# EAGLE design IOT (EAGLE 9.7.0)
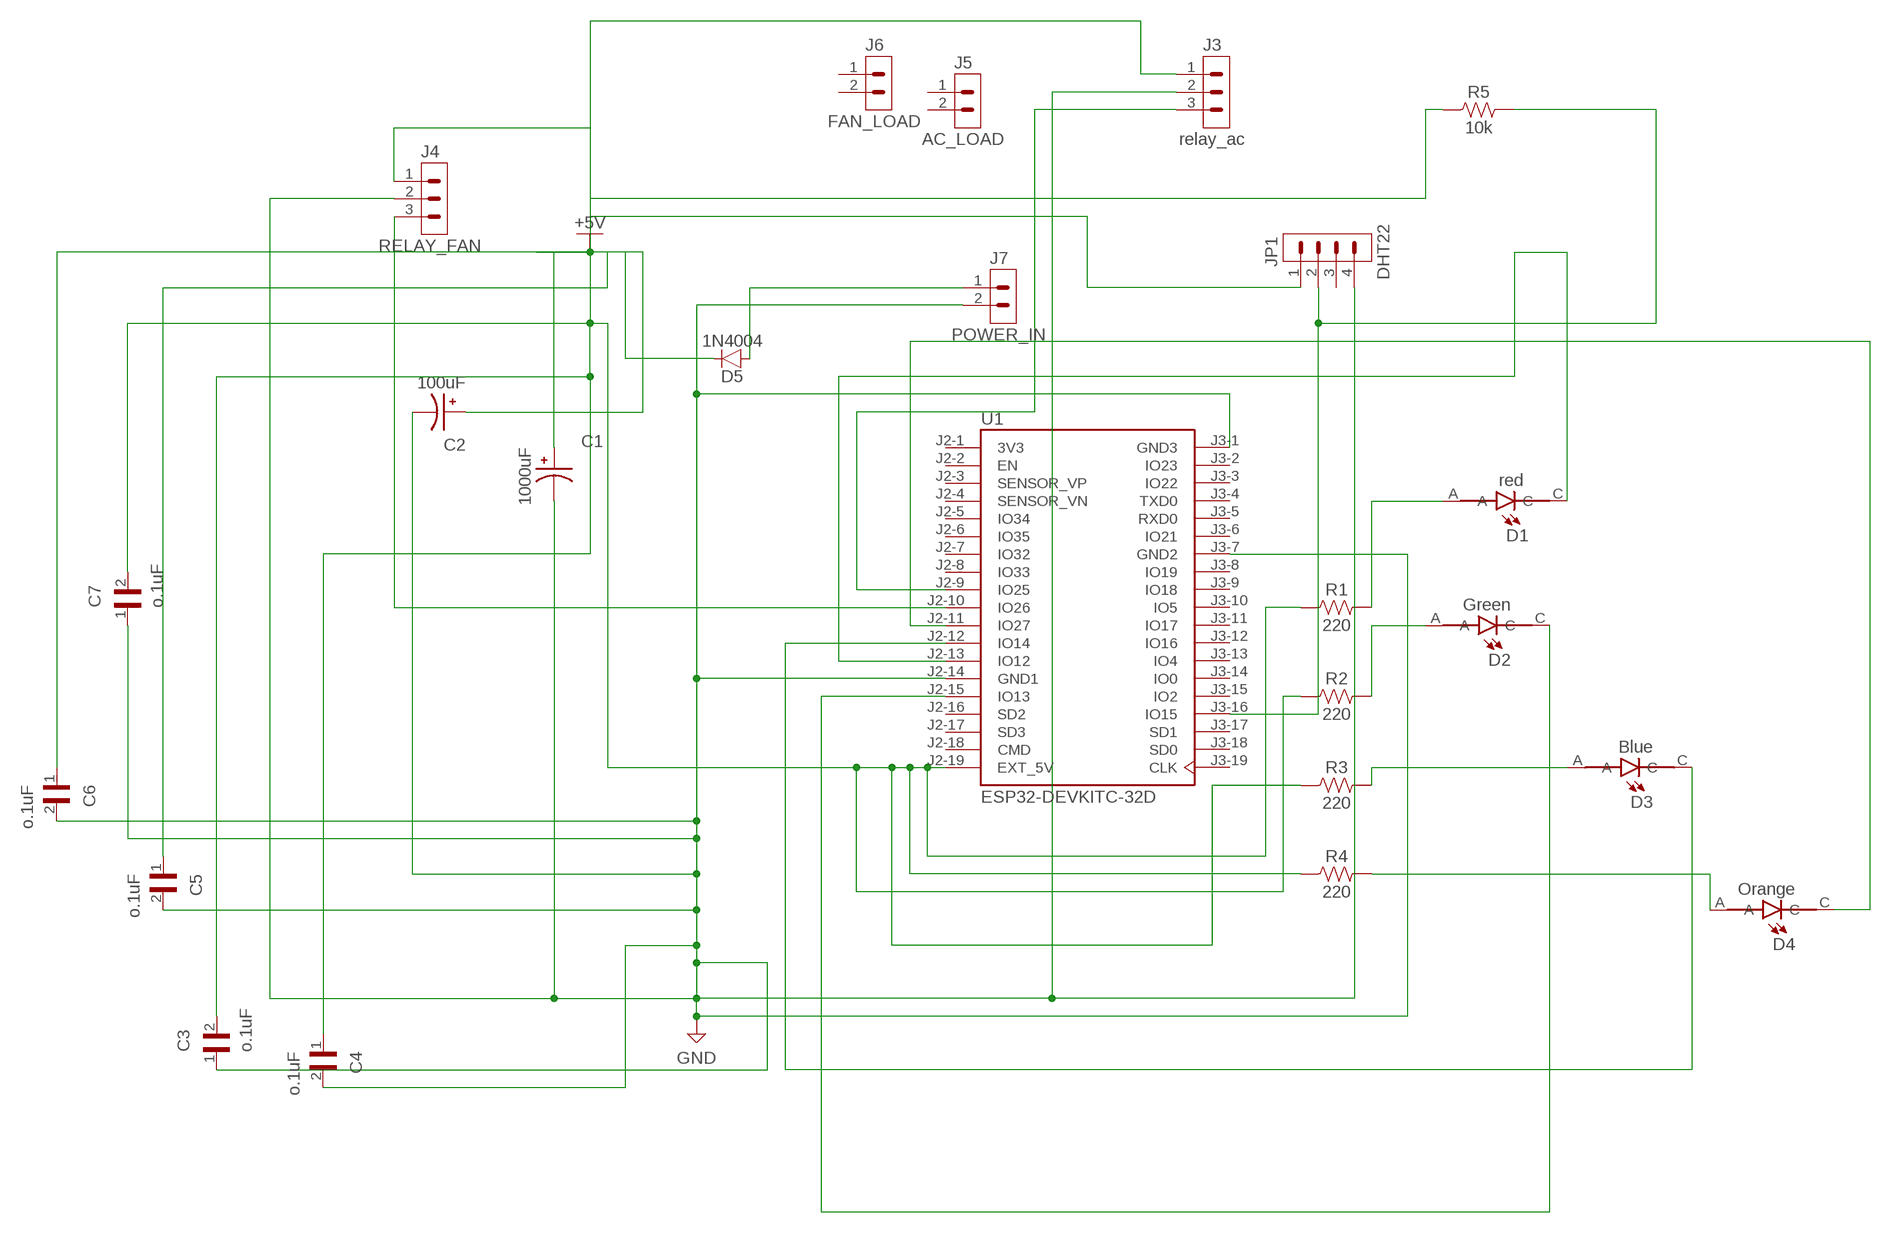
[diagram p0: schematic, sheet 1]

## Parts
C1  1000uF  UPM1K560MPD6  [CAPPRD500W60D1000H1700]
C2  100uF  UPM1K560MPD6  [CAPPRD500W60D1000H1700]
C3  o.1uF  FG26X7R1E106KRT00  [CAPRB500W50L550T350H600]
C4  o.1uF  FG26X7R1E106KRT00  [CAPRB500W50L550T350H600]
C5  o.1uF  FG26X7R1E106KRT00  [CAPRB500W50L550T350H600]
C6  o.1uF  FG26X7R1E106KRT00  [CAPRB500W50L550T350H600]
C7  o.1uF  FG26X7R1E106KRT00  [CAPRB500W50L550T350H600]
D1  red  WP7113ID  [LED_WP7113ID]
D2  Green  WP7113ID  [LED_WP7113ID]
D3  Blue  WP7113ID  [LED_WP7113ID]
D4  Orange  WP7113ID  [LED_WP7113ID]
D5  1N4004  DIODE_1N4004_DO41-10  [DO41-10]
J3  relay_ac  B3P-VH  [B3P-VH_396_3N]
J4  RELAY_FAN  B3P-VH  [B3P-VH_396_3N]
J5  AC_LOAD  B2P-VH  [B2P-VH_396-2N]
J6  FAN_LOAD  B2P-VH  [B2P-VH_396-2N]
J7  POWER_IN  B2P-VH  [B2P-VH_396-2N]
JP1  DHT22  PINHD-1X4  [1X04]
R1  220  R-US_AXIAL-7.2MM-PITCH  [RESAD724W46L381D178B]
R2  220  R-US_AXIAL-7.2MM-PITCH  [RESAD724W46L381D178B]
R3  220  R-US_AXIAL-7.2MM-PITCH  [RESAD724W46L381D178B]
R4  220  R-US_AXIAL-7.2MM-PITCH  [RESAD724W46L381D178B]
R5  10k  R-US_AXIAL-7.2MM-PITCH  [RESAD724W46L381D178B]
U1  ESP32-DEVKITC-32D  [MODULE_ESP32-DEVKITC-32D]

## Nets
+5V: C1.P C2.P C3.2 C4.1 C5.1 C6.1 C7.2 D5.C J3.1 J4.1 JP1.1 R1.1 R2.1 R3.1 R4.1 R5.1 U1.J2-19(EXT_5V)
GND: C1.N C2.N C3.1 C4.2 C5.2 C6.2 C7.1 J3.2 J4.2 J7.2 JP1.4 U1.J2-14(GND1) U1.J3-1(GND3) U1.J3-7(GND2)
N$1: D5.A J7.1
N$2: D1.A R1.2
N$3: D2.A R2.2
N$4: D3.A R3.2
N$5: D4.A R4.2
N$6: D1.C U1.J2-13(IO12)
N$7: D2.C U1.J2-15(IO13)
N$8: D3.C U1.J2-12(IO14)
N$9: D4.C U1.J2-11(IO27)
N$10: JP1.2 R5.2 U1.J3-16(IO15)
N$11: J3.3 U1.J2-9(IO25)
N$12: J4.3 U1.J2-10(IO26)
Unconnected: J5.1 J5.2 J6.1 J6.2 JP1.3 U1.J2-2(EN) U1.J2-3(SENSOR_VP) U1.J2-4(SENSOR_VN) U1.J2-5(IO34) U1.J2-6(IO35) U1.J2-7(IO32) U1.J2-8(IO33) U1.J2-16(SD2) U1.J2-17(SD3) U1.J2-18(CMD) U1.J3-2(IO23) U1.J3-3(IO22) U1.J3-4(TXD0) U1.J3-5(RXD0) U1.J3-6(IO21) U1.J3-8(IO19) U1.J3-9(IO18) U1.J3-10(IO5) U1.J3-11(IO17) U1.J3-12(IO16) U1.J3-13(IO4) U1.J3-14(IO0) U1.J3-15(IO2) U1.J3-17(SD1) U1.J3-18(SD0) U1.J3-19(CLK)

## Power pins joined to a net without a drawn wire
3V3: U1.J2-1(3V3)

## Library data of the parts
C1 C2 = UPM1K560MPD6:UPM1K560MPD6: Check availability <https://pricing.snapeda.com/parts/UPM1K560MPD6/Nichicon/view-part?ref=eda>; AVAILABILITY: In Stock; CHECK_PRICES: https://www.snapeda.com/parts/UPM1K560MPD6/Nichicon/view-part/?ref=eda; DESCRIPTION: Capacitor Aluminum Electrolytic Cap56uF80V 20% Radial 10X15 LS 5mm | Nichicon UPM1K560MPD6; MF: Nichicon; MP: UPM1K560MPD6; PACKAGE: Radial Panasonic Electronic Components; PRICE: None; SNAPEDA_LINK: https://www.snapeda.com/parts/UPM1K560MPD6/Nichicon/view-part/?ref=snap
C3-C7 = FG26X7R1E106KRT00:FG26X7R1E106KRT00: Check availability <https://pricing.snapeda.com/parts/FG26X7R1E106KRT00/TDK/view-part?ref=eda>; AVAILABILITY: In Stock; CHECK_PRICES: https://www.snapeda.com/parts/FG26X7R1E106KRT00/TDK/view-part/?ref=eda; DESCRIPTION: Cap Ceramic 10uF 25V X7R 10% Radial 5mm 125C; MF: TDK; MP: FG26X7R1E106KRT00; PACKAGE: Radial TDK; PRICE: None; SNAPEDA_LINK: https://www.snapeda.com/parts/FG26X7R1E106KRT00/TDK/view-part/?ref=snap
D1-D4 = WP7113ID:WP7113ID: Check availability <https://pricing.snapeda.com/parts/WP7113ID/Kingbright/view-part?ref=eda>; AVAILABILITY: In Stock; CHECK_PRICES: https://www.snapeda.com/parts/WP7113ID/Kingbright/view-part/?ref=eda; DESCRIPTION: Red 617nm LED Indication - Discrete 1.9V Radial; MF: Kingbright; MP: WP7113ID; PACKAGE: Radial Kingbright; PRICE: None; SNAPEDA_LINK: https://www.snapeda.com/parts/WP7113ID/Kingbright/view-part/?ref=snap
D5 = Diode:DIODE_: Diode Rectifier - Popular Parts; CATEGORY: Diode; DATASHEET: https://www.onsemi.com/pdf/datasheet/1n4001-d.pdfv; DESCRIPTION: Diode 400 V 1A Through Hole DO-41; FORWARD_CURRENT: 1 A; FORWARD_VOLTAGE: 1.1 V; MANUFACTURER: onsemi; MPN: 1N4004; OPERATING_TEMPERATURE: -55°C ~ 175°C; PACKAGE_SIZE: DO-41; PACKAGE_TYPE: Through Hole; PART_STATUS: Obsolete; REVERSE_VOLTAGE: NA; ROHS: Compliant; SERIES: 1N4004; SUBCATEGORY: Rectifiers; TYPE: Single Diodes; ZENER_VOLTAGE: NA
J3 J4 = Connector:B3P-VH: VH Connector Top Entry - POS-3POS 7.92MM Reference: Datasheet <http://www.jst-mfg.com/product/pdf/eng/eVH.pdf>; CATEGORY: Connectors; DATASHEET: https://www.jst-mfg.com/product/pdf/eng/eVH.pdf; DESCRIPTION: Connector Header Through Hole 3 position 0.156" (3.96mm); MANUFACTURER: JST Sales America Inc.; MPN: B3P-VH; OPERATING_TEMPERATURE: -25°C ~ 85°C; PACKAGE_SIZE: NA; PACKAGE_TYPE: Through Hole; PART_STATUS: Active; PITCH: 0.156" (3.96mm); ROHS: Compliant; SERIES: VH; SUBCATEGORY: Rectangular Connectors; TYPE: Male Headers
J5-J7 = Connector:B2P-VH: VH Connector Top Entry - 2POS-3.96MM Reference: Datasheet <http://www.jst-mfg.com/product/pdf/eng/eVH.pdf>; CATEGORY: Connectors; DATASHEET: https://www.jst-mfg.com/product/pdf/eng/eVH.pdf; DESCRIPTION: Connector Header Through Hole 3 position 0.156" (3.96mm); MANUFACTURER: JST Sales America Inc.; MPN: B2P-VH; OPERATING_TEMPERATURE: -25°C ~ 85°C; PACKAGE_SIZE: NA; PACKAGE_TYPE: Through Hole; PART_STATUS: Active; PITCH: 0.156" (3.96mm); ROHS: Compliant; SERIES: VH; SUBCATEGORY: Rectangular Connectors; TYPE: Male Headers
JP1 = Connector:PINHD-1X4: Pin Header; CATEGORY: Connectors; DESCRIPTION: Header-Straight-4 Position; PACKAGE_TYPE: Through Hole; PITCH: 0.100" (2.54mm); SUBCATEGORY: Headers; TYPE: Male Pins
R1-R5 = Resistor:R-US: Resistor Fixed - ANSI; CATEGORY: Resistors; DESCRIPTION: Axial Resistor 7.24 mm pitch 3.81 mm body length 1.78 mm body diameter; PACKAGE_SIZE: Axial; PACKAGE_TYPE: Through Hole
U1 = ESP32-DEVKITC-32D:ESP32-DEVKITC-32D: Check availability <https://pricing.snapeda.com/parts/ESP32-DEVKITC-32D/Espressif%20Systems/view-part?ref=eda>; AVAILABILITY: In Stock; CHECK_PRICES: https://www.snapeda.com/parts/ESP32-DEVKITC-32D/Espressif+Systems/view-part/?ref=eda; DESCRIPTION: WiFi Development Tools (802.11) ESP32 General Development Kit, ESP32-WROOM-32D on the board; MF: Espressif Systems; MP: ESP32-DEVKITC-32D; PACKAGE: None; PRICE: None; SNAPEDA_LINK: https://www.snapeda.com/parts/ESP32-DEVKITC-32D/Espressif+Systems/view-part/?ref=snap

## Board
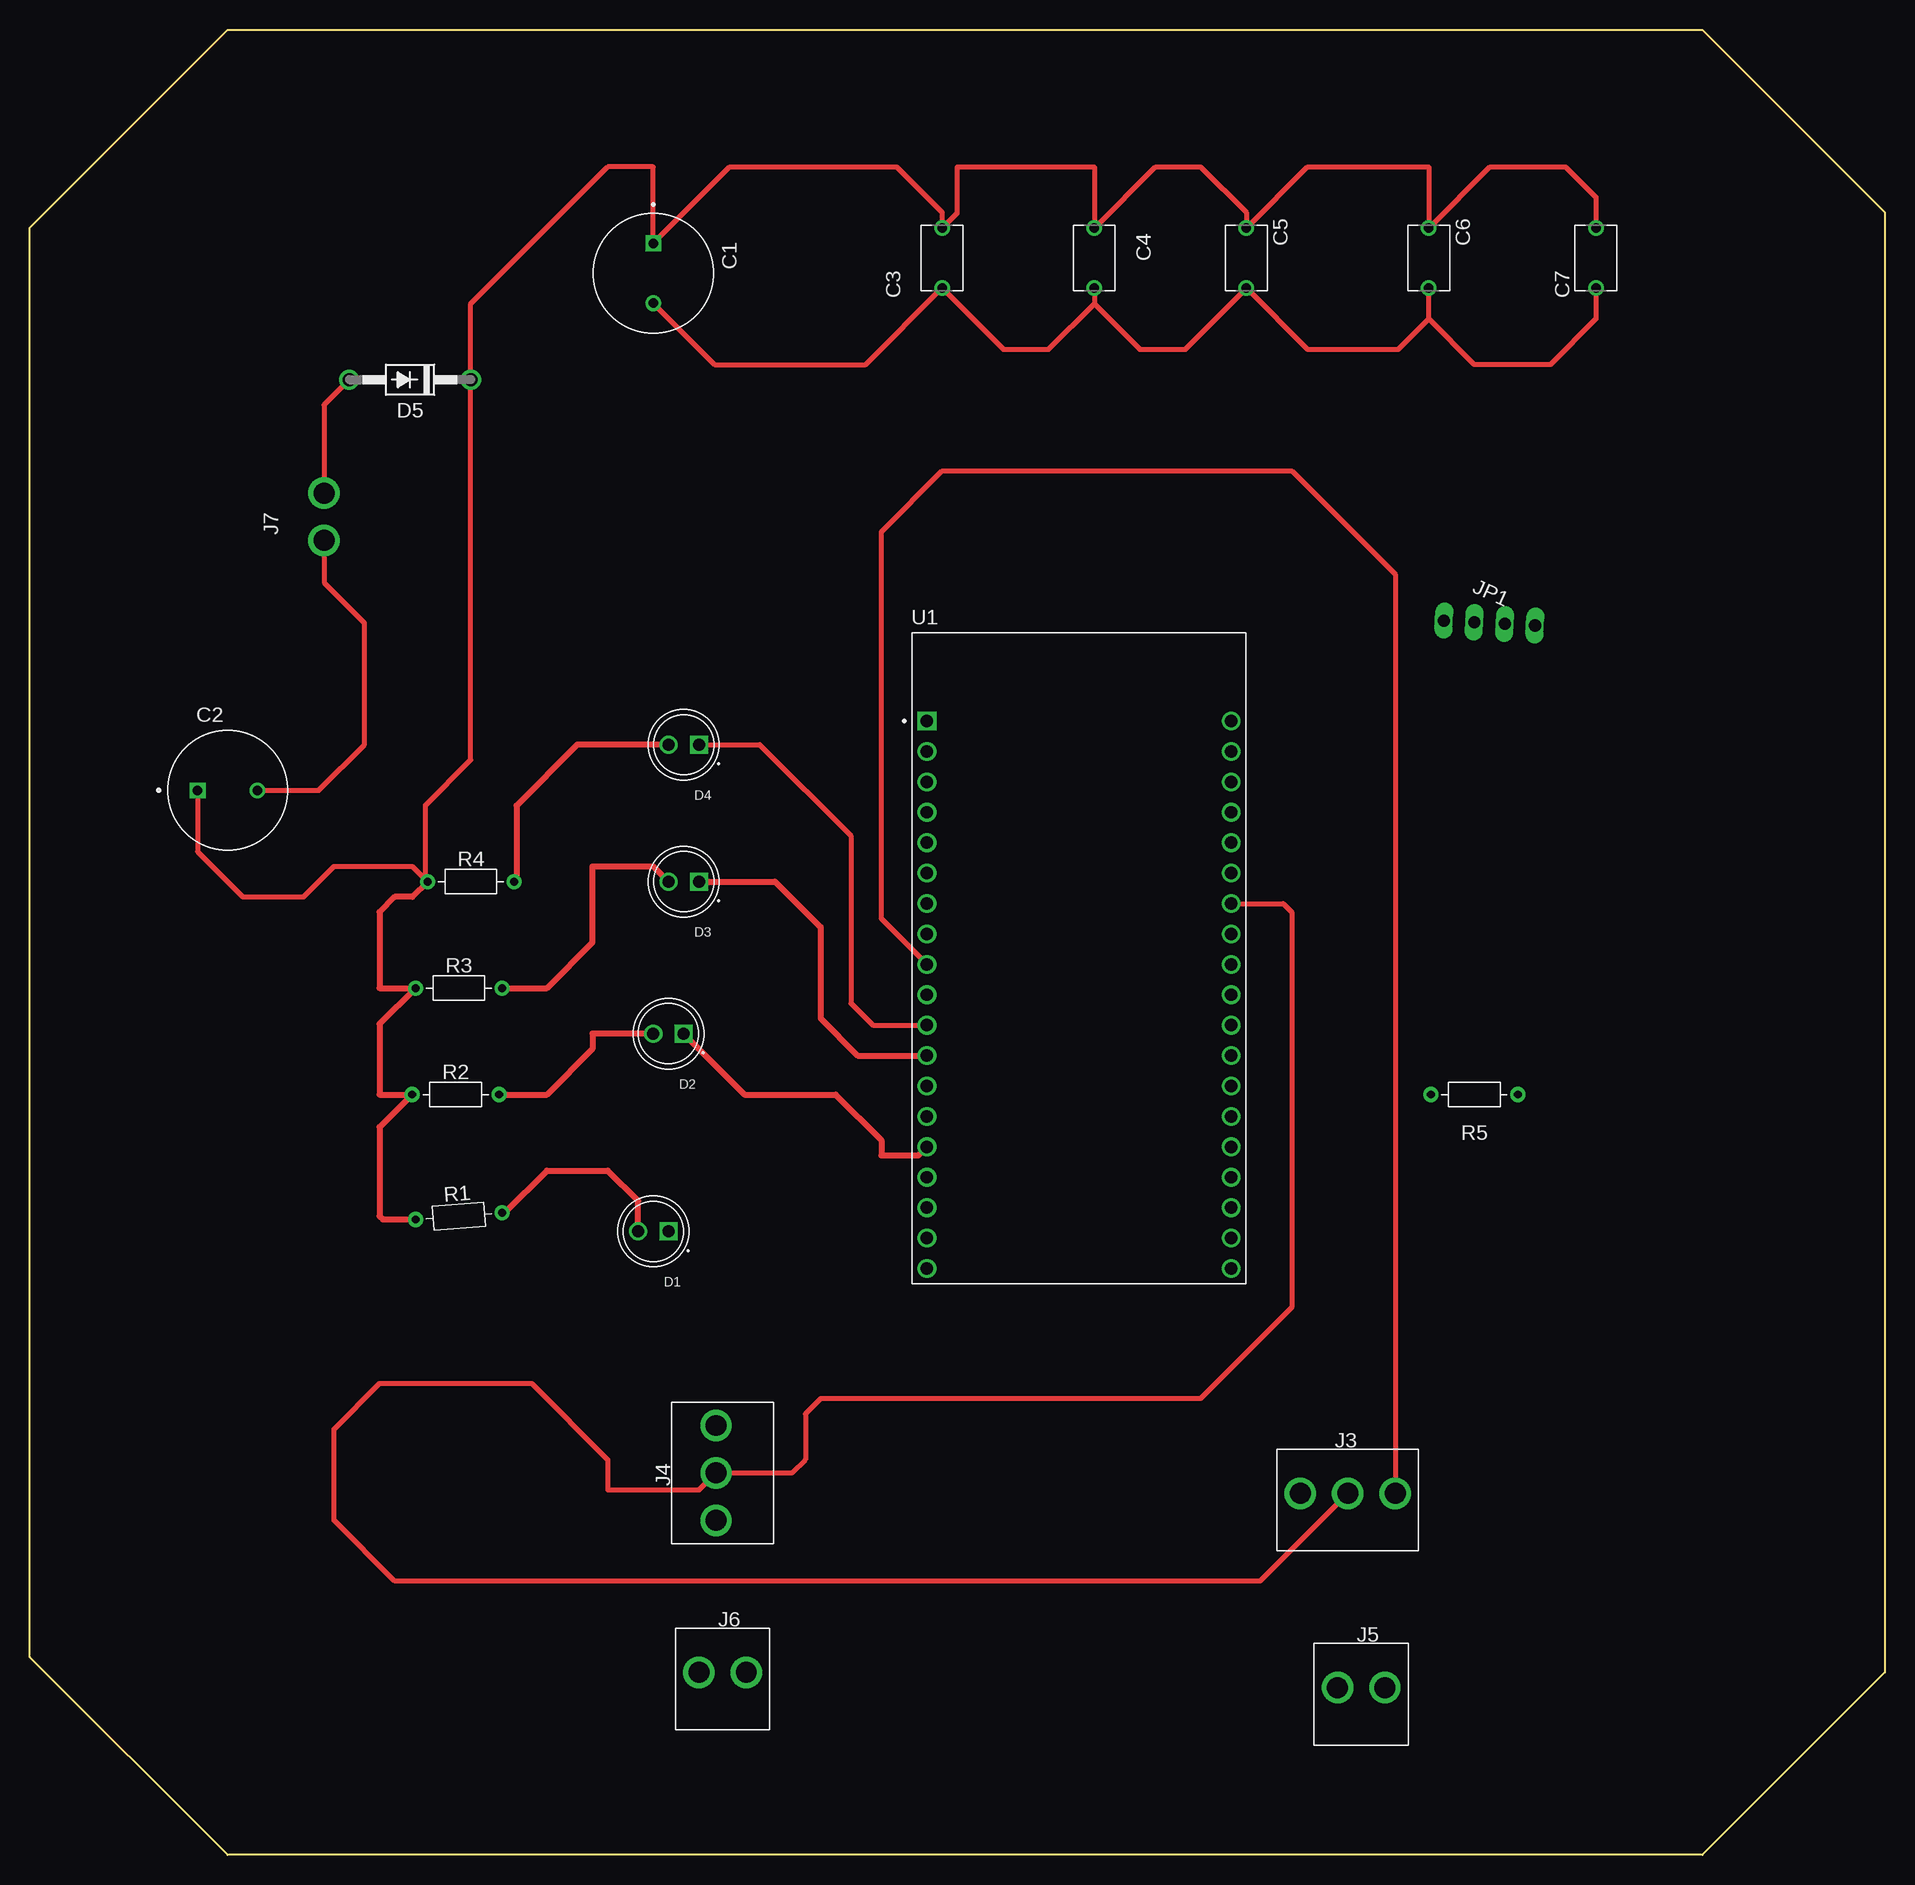
[diagram p1: board, top side]
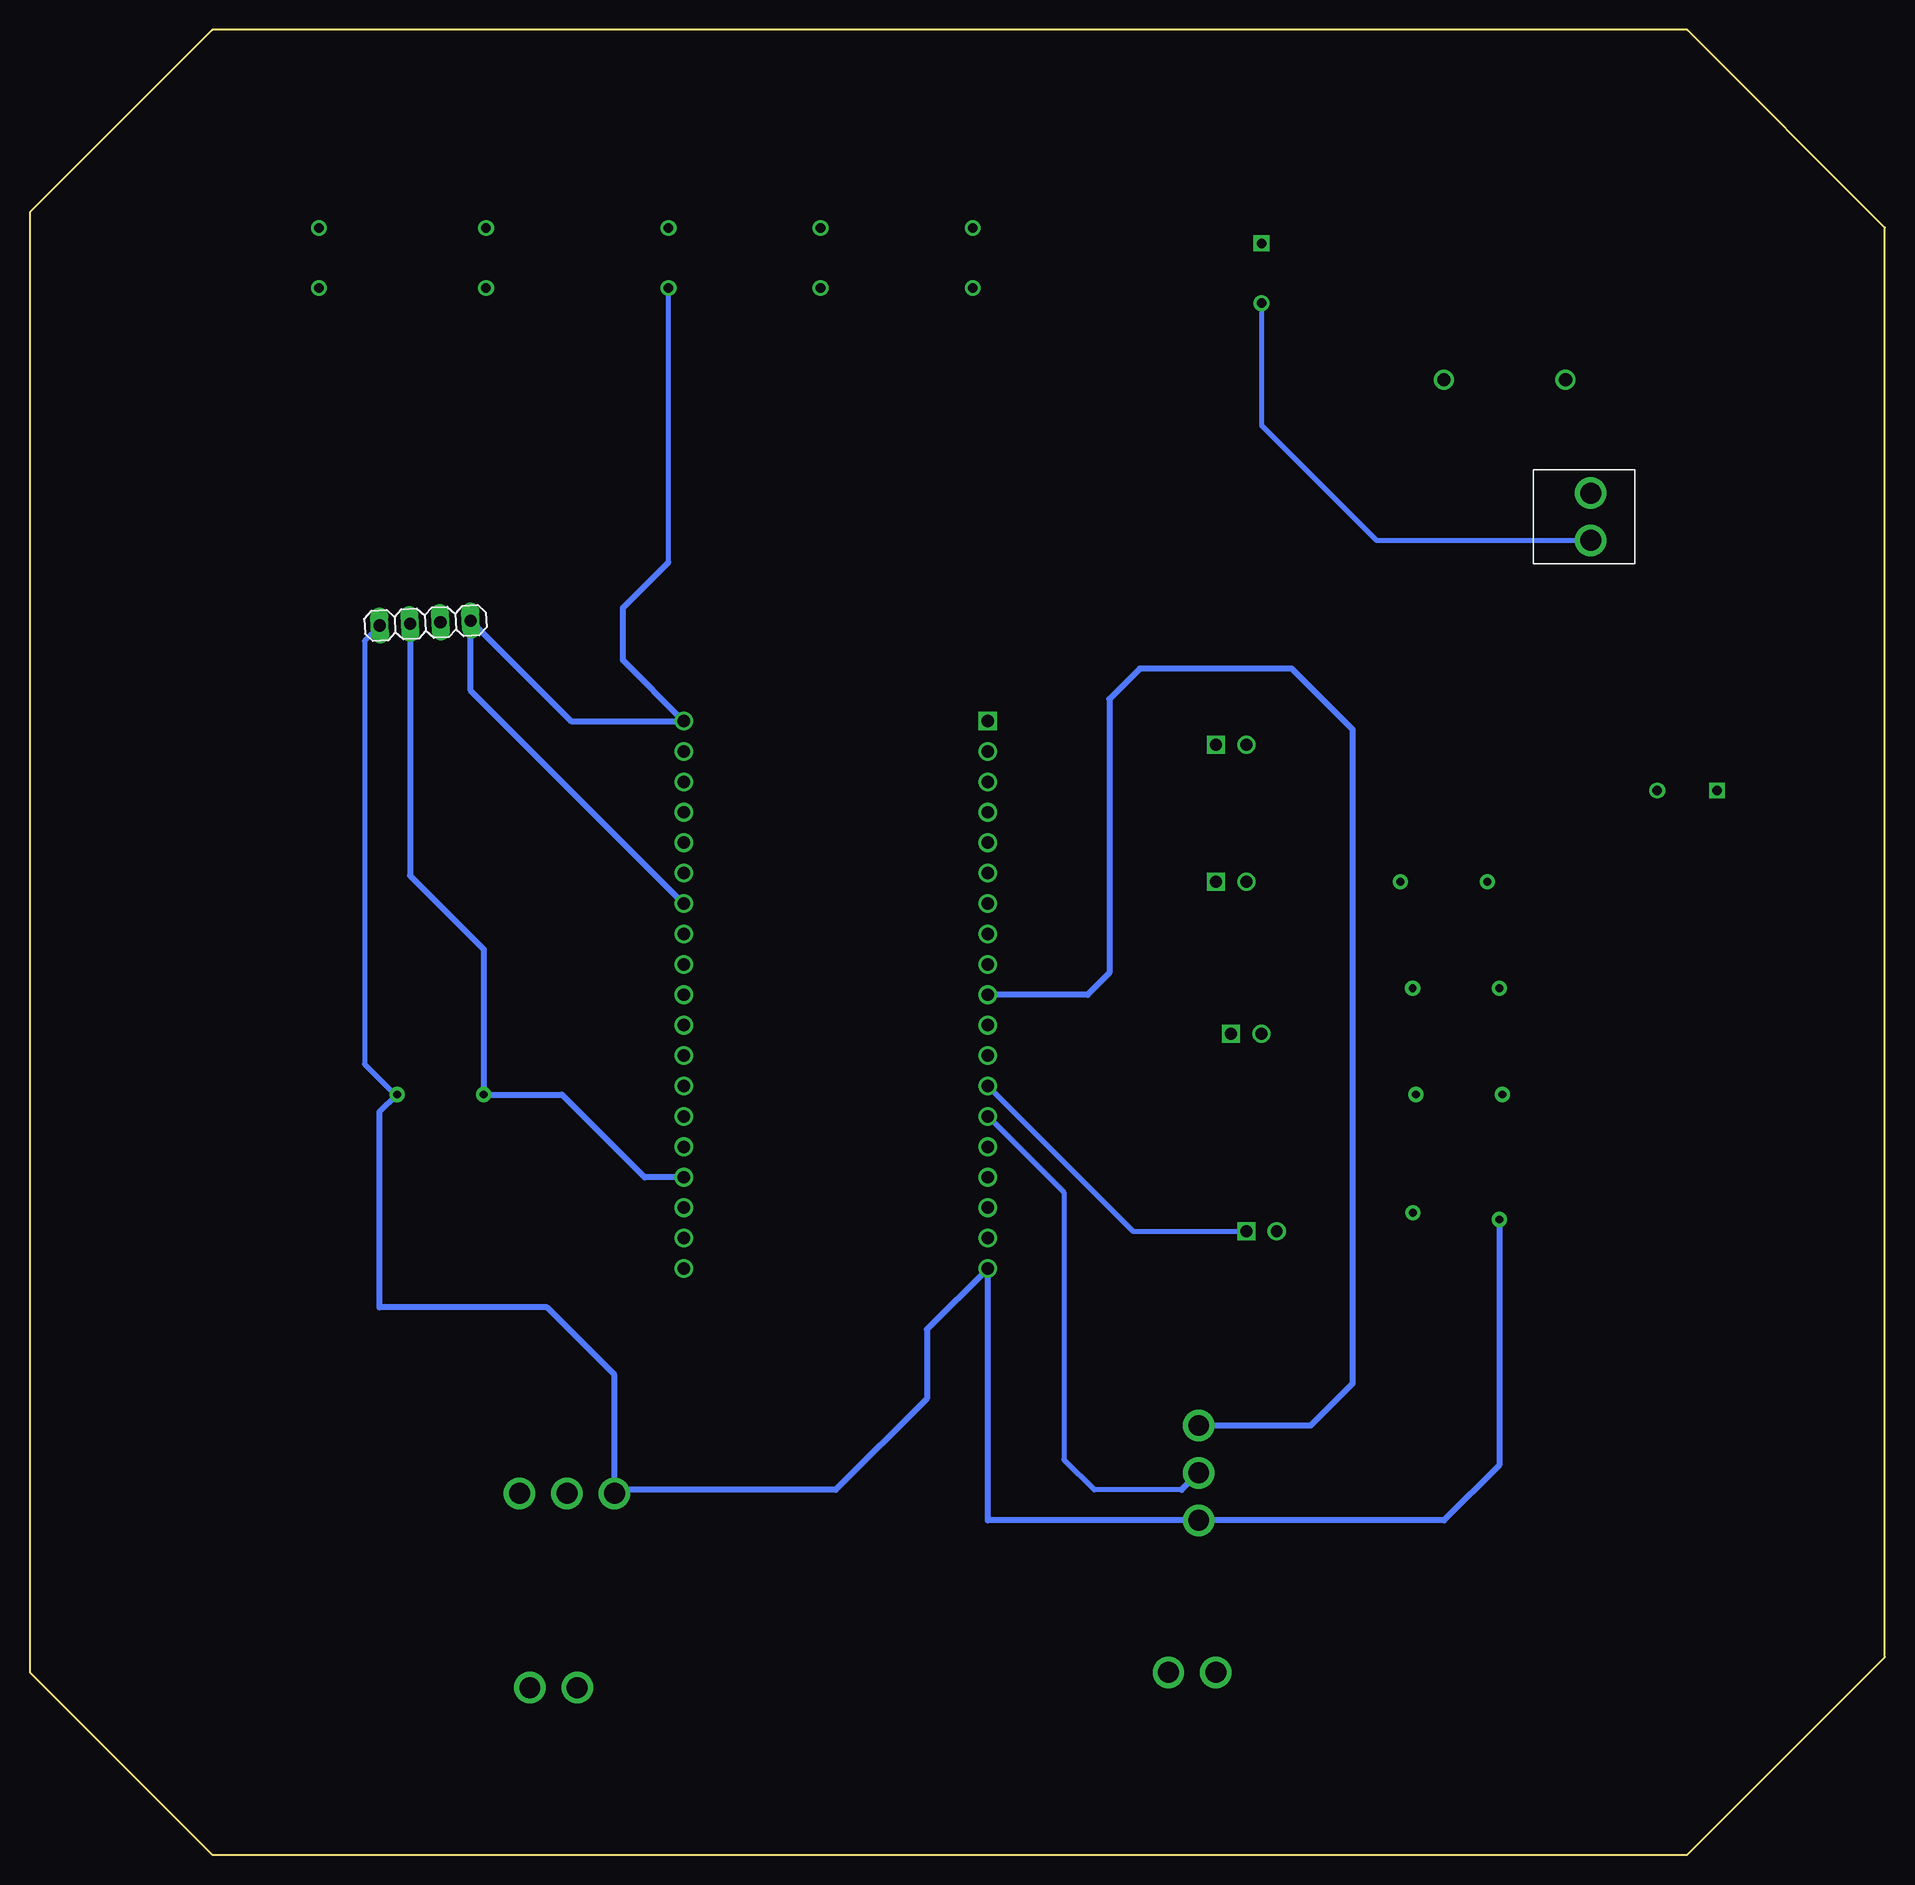
[diagram p2: board, bottom side, seen from below]

Size 154.94 x 152.4 mm. Coordinates in mm from the lower left corner, seen from the top.
Outline: 0,135.89 16.51,152.4 139.7,152.4 154.94,137.16 154.94,15.24 139.7,0 16.51,0 0,16.51 0,135.89
Copper layers (1*16): Top / Bottom
Stack-up Default Layer Stack: Top SilkScreen Epoxy Ink / Top SolderMask SR:Green 0.0254mm Dk 4.3 / Top Surface Finish Lead-Free 0.02mm / Top CuFoil:007 0.035mm / Dielectric-1 User Defined 1.5mm / Bottom CuFoil:007 0.035mm / Bottom Surface Finish Lead-Free 0.02mm / Bottom SolderMask SR:Green 0.0254mm Dk 4.3 / Bottom SilkScreen Epoxy Ink
Design rules: minimum copper width 16mil, minimum drill size 20mil, copper clearance wire_polygon to wire_polygon 6mil, copper clearance wire_polygon to pad_smd 6mil, copper clearance wire_polygon to via 6mil, copper clearance pad_smd to pad_smd 6mil, copper clearance pad_smd to via 6mil, copper clearance via to via 6mil, copper clearance smd to pad (same net) 6mil, copper clearance smd to via (same net) 6mil, copper clearance smd to smd (same net) 6mil, dimension clearance 40mil, via restrict clearance 0mil, restrict clearance 0mil, drill distance 6mil, keepout clearance 0mil

### Footprints (pad centres in the part's own frame; a part is rotated, then mirrored left to right if it is on the bottom)
CAPPRD500W60D1000H1700 = drill 0.8 pad 1.15: N 2.5,0 | drill 0.8 pad 1.15 square: P -2.5,0
CAPRB500W50L550T350H600 = drill 0.8 pad 1.15: 1 -2.5,0; 2 2.5,0
LED_WP7113ID = drill 1: A 1.27,0 | drill 1 square: C -1.27,0
DO41-10 = drill 1.118: A 5.08,0; C -5.08,0
B3P-VH_396_3N = drill 1.75: 1 0,0; 2 3.96,0; 3 7.92,0
B2P-VH_396-2N = drill 1.75: 1 0,0; 2 3.96,0
1X04 = drill 1.016 long: 1 -3.81,0; 2 -1.27,0; 3 1.27,0; 4 3.81,0
RESAD724W46L381D178B = drill 0.66 pad 1.26: 1 -3.62,0; 2 3.62,0
MODULE_ESP32-DEVKITC-32D = drill 1.04 square: J2-1 -12.7,19.76 | drill 1.04: J2-2 -12.7,17.22; J2-3 -12.7,14.68; J2-4 -12.7,12.14; J2-5 -12.7,9.6; J2-6 -12.7,7.06; J2-7 -12.7,4.52; J2-8 -12.7,1.98; J2-9 -12.7,-0.56; J2-10 -12.7,-3.1; J2-11 -12.7,-5.64; J2-12 -12.7,-8.18; J2-13 -12.7,-10.72; J2-14 -12.7,-13.26; J2-15 -12.7,-15.8; J2-16 -12.7,-18.34; J2-17 -12.7,-20.88; J2-18 -12.7,-23.42; J2-19 -12.7,-25.96; J3-1 12.7,19.76; J3-2 12.7,17.22; J3-3 12.7,14.68; J3-4 12.7,12.14; J3-5 12.7,9.6; J3-6 12.7,7.06; J3-7 12.7,4.52; J3-8 12.7,1.98; J3-9 12.7,-0.56; J3-10 12.7,-3.1; J3-11 12.7,-5.64; J3-12 12.7,-8.18; J3-13 12.7,-10.72; J3-14 12.7,-13.26; J3-15 12.7,-15.8; J3-16 12.7,-18.34; J3-17 12.7,-20.88; J3-18 12.7,-23.42; J3-19 12.7,-25.96

### Placement (x,y rotation side)
C1  52.07,132.08 270 top
C2  16.51,88.9 0 top
C3  76.2,133.35 90 top
C4  88.9,133.35 270 top
C5  101.6,133.35 270 top
C6  116.84,133.35 270 top
C7  130.81,133.35 90 top
D1  52.07,52.07 180 top
D2  53.34,68.58 180 top
D3  54.61,81.28 180 top
D4  54.61,92.71 180 top
D5  31.75,123.19 180 top
J3  106.12,30.19 0 top
J4  57.31,27.94 90 top
J5  109.22,13.97 0 top
J6  55.88,15.24 0 top
J7  24.57,113.73 270 bottom
JP1  121.92,102.87 3.1 bottom
R1  35.82,53.34 4.4 top
R2  35.56,63.5 0 top
R3  35.82,72.39 0 top
R4  36.83,81.28 0 top
R5  120.65,63.5 180 top
U1  87.63,74.93 0 top

### Tracks (layer width: path | path; a pad name or v marks a point on that pad's centre or on a via)
+5V
  Top 0.406: 33.02,81.47 33.02,87.63 36.83,91.44 D5.C 36.83,129.54 48.26,140.97 52.07,140.97 C1.P 58.46,140.97 72.39,140.97 76.2,137.16 C3.2 77.47,137.12 77.47,140.97 88.9,140.97 C4.1 94.02,140.97 97.79,140.97 101.6,137.16 C5.1 106.72,140.97 116.84,140.97 C6.1 121.96,140.97 128.27,140.97 130.81,138.43 C7.2 | 33.02,81.47 R4.1 | C2.P 14.01,83.78 17.78,80.01 22.86,80.01 25.4,82.55 31.94,82.55 33.02,81.47
  Top 0.508: R4.1 31.94,80.01 30.48,80.01 29.21,78.74 29.21,72.39 R3.1 29.21,69.4 29.21,63.5 R2.1 29.21,60.77 29.21,53.34 29.49,53.06 R1.1
  Bottom 0.406: JP1.1 127,101.39 127,66.04 124.56,63.59 124.37,63.59
  Bottom 0.508: 124.37,63.59 R5.1 125.73,62.04 125.73,45.72 111.76,45.72 106.12,40.08 J3.1 105.83,30.48 87.63,30.48 80.01,38.1 80.01,43.89 U1.J2-19 74.93,27.94 J4.1 36.83,27.94 32.21,32.56 R1.1
GND
  Top 0.406: 24.85,109.49 24.62,109.71 | 24.62,109.71 J7.2 | C1.N 57.19,124.46 69.81,124.46 C3.1 81.32,125.73 85.09,125.73 88.9,129.54 | C4.2 88.9,129.54 | 88.9,129.54 92.71,125.73 96.52,125.73 101.6,130.81 C5.2 106.72,125.73 114.3,125.73 116.84,128.27 | C7.1 130.81,128.27 127,124.46 120.65,124.46 116.84,128.27 | 116.84,128.27 C6.2 | U1.J3-7 104.7,79.45 105.41,78.74 105.41,45.72 97.79,38.1 66.04,38.1 64.77,36.83 64.77,33.02 63.65,31.9 J4.2 55.89,30.48 48.26,30.48 48.26,33.02 41.91,39.37 29.21,39.37 25.4,35.56 25.4,27.94 30.48,22.86 102.75,22.86 J3.2 | C2.N 24.13,88.9 27.94,92.71 27.94,102.87 24.62,106.19 24.62,109.71
  Bottom 0.406: U1.J2-14 68.58,55.32 68.58,33.02 66.04,30.48 58.73,30.48 | 101.6,107.95 C5.2 | C1.N 52.07,119.38 42.46,109.77 J7.2
  Bottom 0.508: U1.J3-7 118.12,97.24 JP1.4 109.73,94.69 U1.J3-1 105.41,99.77 105.41,104.14 101.6,107.95 | J4.2 58.73,30.48
N$1
  Top 0.406: D5.A 24.57,121.09 J7.1
N$2
  Top 0.508: R1.2 39.65,53.62 43.18,57.15 48.26,57.15 50.8,54.61 D1.A
N$3
  Top 0.508: R2.2 43.18,63.5 46.99,67.31 46.99,68.58 D2.A
N$4
  Top 0.508: R3.2 43.18,72.39 46.99,76.2 46.99,82.55 52.07,82.55 D3.A
N$5
  Top 0.508: D4.A 45.72,92.71 40.64,87.63 40.64,81.28 R4.2
N$6
  Bottom 0.406: U1.J2-13 62.79,52.07 D1.C
N$7
  Top 0.508: D2.C 59.69,63.5 67.31,63.5 71.12,59.69 71.12,58.42 74.22,58.42 U1.J2-15
N$8
  Top 0.508: D3.C 62.23,81.28 66.04,77.47 66.04,69.85 69.14,66.75 U1.J2-12
N$9
  Top 0.406: D4.C 60.96,92.71 68.58,85.09 68.58,71.12 70.41,69.29 U1.J2-11
N$10
  Bottom 0.508: U1.J3-16 103.58,56.59 110.49,63.5 R5.2 117.03,75.62 123.19,81.77 JP1.2
N$11
  Top 0.406: U1.J2-9 71.12,78.18 71.12,110.49 76.2,115.57 105.41,115.57 114.04,106.94 J3.3
N$12
  Bottom 0.508: 57.15,36.02 J4.3 47.96,35.86 44.45,39.37 44.45,93.98 49.53,99.06 62.23,99.06 64.77,96.52 64.77,73.66 66.6,71.83 U1.J2-10